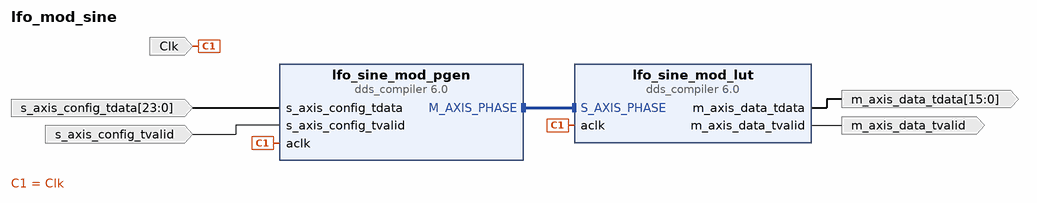
[diagram p0: block diagram of the top level]
# Vivado block design lfo_mod_sine, xc7s50csga324-1, Vivado 2022.2
create_bd_design lfo_mod_sine

create_bd_port -dir I Clk
create_bd_port -dir I s_axis_config_tvalid
create_bd_port -dir O -from 15 -to 0 m_axis_data_tdata
create_bd_port -dir O m_axis_data_tvalid
create_bd_port -dir I -from 23 -to 0 s_axis_config_tdata

create_bd_cell -type ip -vlnv xilinx.com:ip:dds_compiler:6.0 lfo_sine_mod_pgen
set_property -dict [list \
  CONFIG.DATA_Has_TLAST Not_Required \
  CONFIG.DDS_Clock_Rate 0.0441 \
  CONFIG.Latency 1 \
  CONFIG.M_DATA_Has_TUSER Not_Required \
  CONFIG.Noise_Shaping None \
  CONFIG.Output_Frequency1 0 \
  CONFIG.Output_Width 3 \
  CONFIG.Parameter_Entry Hardware_Parameters \
  CONFIG.PartsPresent Phase_Generator_only \
  CONFIG.Phase_Increment Programmable \
  CONFIG.Phase_Width 22 \
  CONFIG.S_PHASE_Has_TUSER Not_Required \
] [get_bd_cells lfo_sine_mod_pgen]
create_bd_cell -type ip -vlnv xilinx.com:ip:dds_compiler:6.0 lfo_sine_mod_lut
set_property -dict [list \
  CONFIG.Amplitude_Mode Unit_Circle \
  CONFIG.DATA_Has_TLAST Not_Required \
  CONFIG.Has_Phase_Out false \
  CONFIG.Latency 7 \
  CONFIG.M_DATA_Has_TUSER Not_Required \
  CONFIG.M_PHASE_Has_TUSER Not_Required \
  CONFIG.Noise_Shaping Taylor_Series_Corrected \
  CONFIG.Output_Frequency1 0 \
  CONFIG.Output_Selection Sine \
  CONFIG.Output_Width 16 \
  CONFIG.PINC1 0 \
  CONFIG.Parameter_Entry Hardware_Parameters \
  CONFIG.PartsPresent SIN_COS_LUT_only \
  CONFIG.Phase_Width 22 \
  CONFIG.S_PHASE_Has_TUSER Not_Required \
] [get_bd_cells lfo_sine_mod_lut]

# ---- connections ----

connect_bd_intf_net [get_bd_intf_pins lfo_sine_mod_pgen/M_AXIS_PHASE] [get_bd_intf_pins lfo_sine_mod_lut/S_AXIS_PHASE]
connect_bd_net [get_bd_ports Clk] [get_bd_pins lfo_sine_mod_pgen/aclk] [get_bd_pins lfo_sine_mod_lut/aclk]
connect_bd_net -net dds_compiler_0_m_axis_data_tdata [get_bd_pins lfo_sine_mod_lut/m_axis_data_tdata] [get_bd_ports m_axis_data_tdata]
connect_bd_net -net dds_compiler_0_m_axis_data_tvalid [get_bd_pins lfo_sine_mod_lut/m_axis_data_tvalid] [get_bd_ports m_axis_data_tvalid]
connect_bd_net [get_bd_ports s_axis_config_tdata] [get_bd_pins lfo_sine_mod_pgen/s_axis_config_tdata]
connect_bd_net [get_bd_ports s_axis_config_tvalid] [get_bd_pins lfo_sine_mod_pgen/s_axis_config_tvalid]

validate_bd_design
save_bd_design
